# Altium project Pod3.PrjPcb
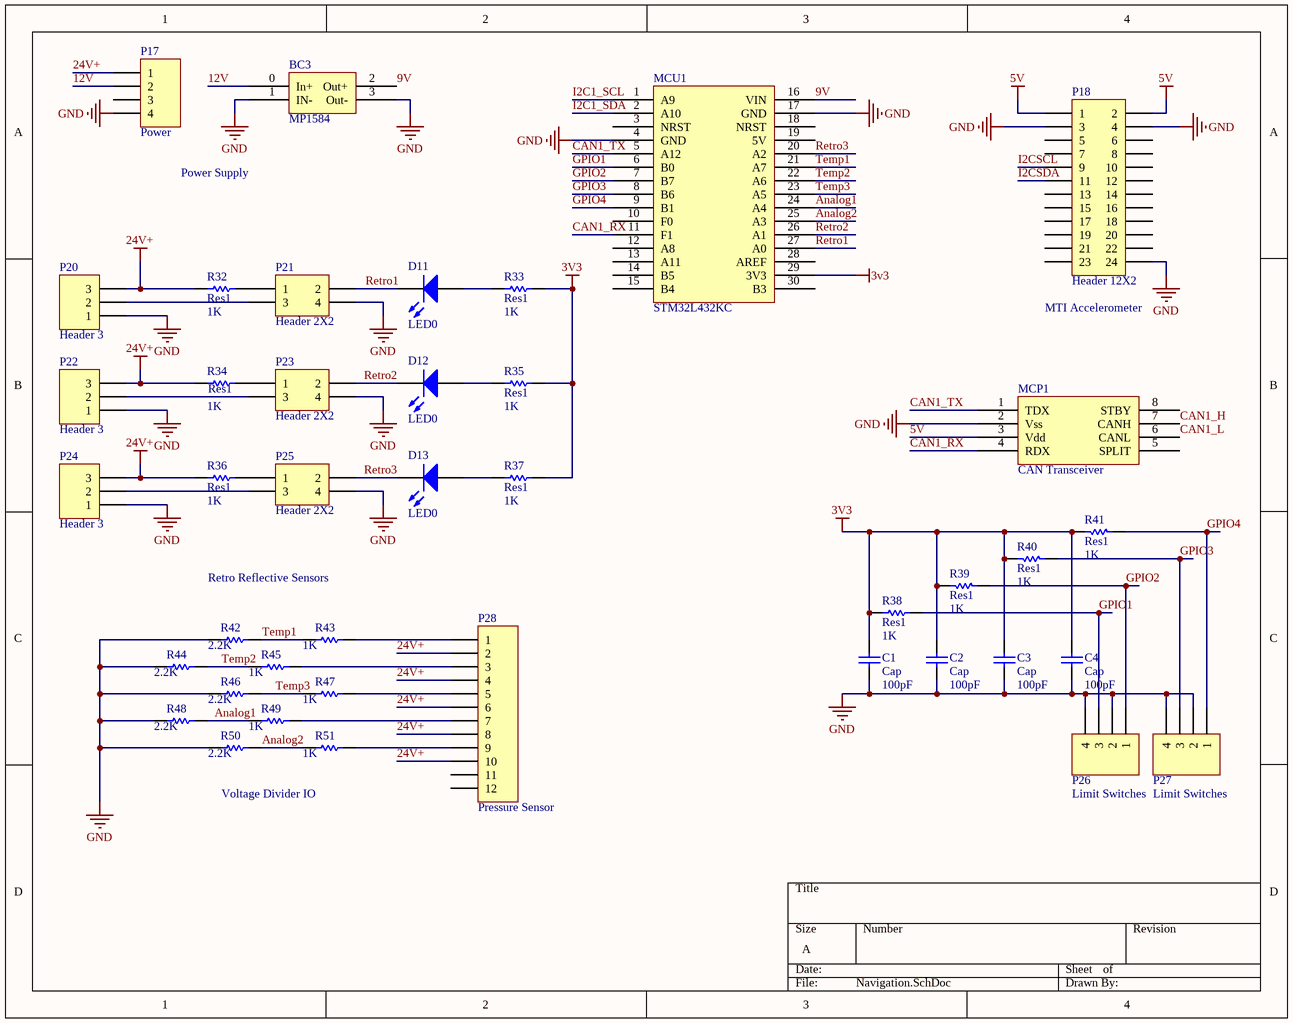
[diagram p0: Navigation.SchDoc]
3 sheets, 88 parts. Net scope: flat (ports and power ports of the same name join across sheets).
Board files: Navigation.PcbDoc, Braking.PcbDoc, Propulsion.PcbDoc, Communication.PcbDoc, ControlPanel.PcbDoc
Sheets:
  Navigation.SchDoc
  Communication.SchDoc
  MotorController.SchDoc

## Sheet Navigation.SchDoc
size A

### Parts
BC3  MP1584
C1  Cap  value 100pF  [SMD Capacitor]
C2  Cap  value 100pF  [SMD Capacitor]
C3  Cap  value 100pF  [SMD Capacitor]
C4  Cap  value 100pF  [SMD Capacitor]
D11  LED0  [LED-0]
D12  LED0  [LED-0]
D13  LED0  [LED-0]
MCP1  CAN Transceiver
MCU1  STM32L432KC
P17  Power  [HDR1X4]
P18  Header 12X2  [HDR2X12]
P20  Header 3  [HDR1X3]
P21  Header 2X2  [HDR2X2]
P22  Header 3  [HDR1X3]
P23  Header 2X2  [HDR2X2]
P24  Header 3  [HDR1X3]
P25  Header 2X2  [HDR2X2]
P26  Limit Switches  [HDR1X4]
P27  Limit Switches  [HDR1X4]
P28  Pressure Sensor  [HDR1X12]
R32  Res1  value 1K  [SMD Resistor]
R33  Res1  value 1K  [SMD Resistor]
R34  Res1  value 1K  [SMD Resistor]
R35  Res1  value 1K  [SMD Resistor]
R36  Res1  value 1K  [SMD Resistor]
R37  Res1  value 1K  [SMD Resistor]
R38  Res1  value 1K  [SMD Resistor]
R39  Res1  value 1K  [SMD Resistor]
R40  Res1  value 1K  [SMD Resistor]
R41  Res1  value 1K  [SMD Resistor]
R42  value 2.2K  [SMD Resistor]  (hidden comment: Res1)
R43  value 1K  [SMD Resistor]  (hidden comment: Res1)
R44  value 2.2K  [SMD Resistor]  (hidden comment: Res1)
R45  value 1K  [SMD Resistor]  (hidden comment: Res1)
R46  value 2.2K  [SMD Resistor]  (hidden comment: Res1)
R47  value 1K  [SMD Resistor]  (hidden comment: Res1)
R48  value 2.2K  [SMD Resistor]  (hidden comment: Res1)
R49  value 1K  [SMD Resistor]  (hidden comment: Res1)
R50  value 2.2K  [SMD Resistor]  (hidden comment: Res1)
R51  value 1K  [SMD Resistor]  (hidden comment: Res1)

### Nets
3V3: C1.2 C2.2 C3.2 C4.2 MCU1.29(3V3) R33.2 R35.2 R37.2 R38.1 R39.2 R40.2 R41.2
5V: MCP1.3(Vdd) P18.1 P18.2
24V+: P17.1 P20.3 P22.3 P24.3 P28.2 P28.4 P28.6 P28.8 P28.10 R32.1 R34.1 R36.1
GND: BC3.1(IN-) BC3.3(Out-) C1.1 C2.1 C3.1 C4.1 MCP1.2(Vss) MCU1.4(GND) MCU1.17(GND) P17.4 P18.3 P18.4 P18.24 P20.1 P21.4 P22.1 P23.4 P24.1 P25.4 P26.2 P26.4 P27.2 P27.4 R42.1 R44.1 R46.1 R48.1 R50.1  [project net NetLabel69]
9V: BC3.2(Out+) MCU1.16(VIN)
12V: BC3.0(In+) P17.2
Analog1: MCU1.24(A4) R48.2 R49.1
Analog2: MCU1.25(A3) R50.2 R51.1
CAN1_H: MCP1.7(CANH)
CAN1_L: MCP1.6(CANL)
CAN1_RX: MCP1.4(RDX) MCU1.11(F1)
CAN1_TX: MCP1.1(TDX) MCU1.5(A12)
GPIO1: MCU1.6(B0) P26.3 R38.2
GPIO2: MCU1.7(B7) P26.1 R39.1
GPIO3: MCU1.8(B6) P27.3 R40.1
GPIO4: MCU1.9(B1) P27.1 R41.1
I2C1_SCL: MCU1.1(A9)
I2C1_SDA: MCU1.2(A10)
I2CSCL: P18.9
I2CSDA: P18.11
Retro1: D11.2(K) MCU1.27(A0) P21.2
Retro2: D12.2(K) MCU1.26(A1) P23.2
Retro3: D13.2(K) MCU1.20(A2) P25.2
Temp1: MCU1.21(A7) R42.2 R43.1
Temp2: MCU1.22(A6) R44.2 R45.1
Temp3: MCU1.23(A5) R46.2 R47.1
NetD11_1: D11.1(A) R33.1
NetD12_1: D12.1(A) R35.1
NetD13_1: D13.1(A) R37.1
NetP20_2: P20.2 P21.3
NetP21_1: P21.1 R32.2
NetP22_2: P22.2 P23.3
NetP23_1: P23.1 R34.2
NetP24_2: P24.2 P25.3
NetP25_1: P25.1 R36.2
NetP28_1: P28.1 R43.2
NetP28_3: P28.3 R45.2
NetP28_5: P28.5 R47.2
NetP28_7: P28.7 R49.2
NetP28_9: P28.9 R51.2

Not connected (* = marked no-connect by the designer): MCP1 5(SPLIT) 8(STBY); MCU1 3(NRST) 10(F0) 12(A8) 13(A11) 14(B5) 15(B4) 18(NRST) 19(5V) 28(AREF) 30(B3); P17 3; P18 5 6 7 8 10 12 13 14 15 16 17 18 19 20 21 22 23; P28 11 12

### Notes on the sheet
- Power Supply
- (near P18) MTI Accelerometer
- Retro Reflective Sensors
- Voltage Divider IO

### Library data of the parts
C1-C4 = Cap: Capacitor; Published: 8-Jun-2000; LatestRevisionDate: 17-Jul-2002; LatestRevisionNote: Re-released for DXP Platform.; PackageReference: RAD-0.3; Publisher: Altium Limited; PackageDescription: Radial Cap, Thru-Hole; 2 Leads; 0.3 in Pin Spacing
D11-D13 = LED0: Typical INFRARED GaAs LED; Published: 8-Jun-2000; LatestRevisionDate: 08-Jul-2005; LatestRevisionNote: Mech Layer 1 removed.; PackageReference: LED-0; Publisher: Altium Limited; PackageDescription: LED; 2 Leads
MCP1 = CAN_TRANS: ComponentLink1Description: MCP2557FD; ComponentLink1URL: https://www.mouser.com/productdetail/microchip-technology/mcp2557fd-h-sn?qs=sGAEpiMZZMsGqoCZrYwANkLWU4Se4IrDu%2FrtAtMTObg%3D
MCU1 = STMF303K8
P17 P26 P27 = Header 4: Header, 4-Pin; LatestRevisionDate: 17-Jul-2002; LatestRevisionNote: Re-released for DXP Platform.; Publisher: Altium Limited
P18 = Header 12X2: Header, 12-Pin, Dual row; LatestRevisionDate: 17-Jul-2002; LatestRevisionNote: Re-released for DXP Platform.; Publisher: Altium Limited
P20 P22 P24 = Header 3: Header, 3-Pin; LatestRevisionDate: 17-Jul-2002; LatestRevisionNote: Re-released for DXP Platform.; Publisher: Altium Limited
P21 P23 P25 = Header 2X2: Header, 2-Pin, Dual row; LatestRevisionDate: 17-Jul-2002; LatestRevisionNote: Re-released for DXP Platform.; Publisher: Altium Limited
P28 = Header 12: Header, 12-Pin; LatestRevisionDate: 17-Jul-2002; LatestRevisionNote: Re-released for DXP Platform.; Publisher: Altium Limited
R32-R51 = Res1: Resistor; Published: 8-Jun-2000; LatestRevisionDate: 17-Jul-2002; LatestRevisionNote: Re-released for DXP Platform.; PackageReference: AXIAL-0.3; Publisher: Altium Limited; PackageDescription: Axial Device, Thru-Hole; 2 Leads; 0.3 in Pin Spacing

## Sheet Communication.SchDoc
size A; SheetNumber: 4
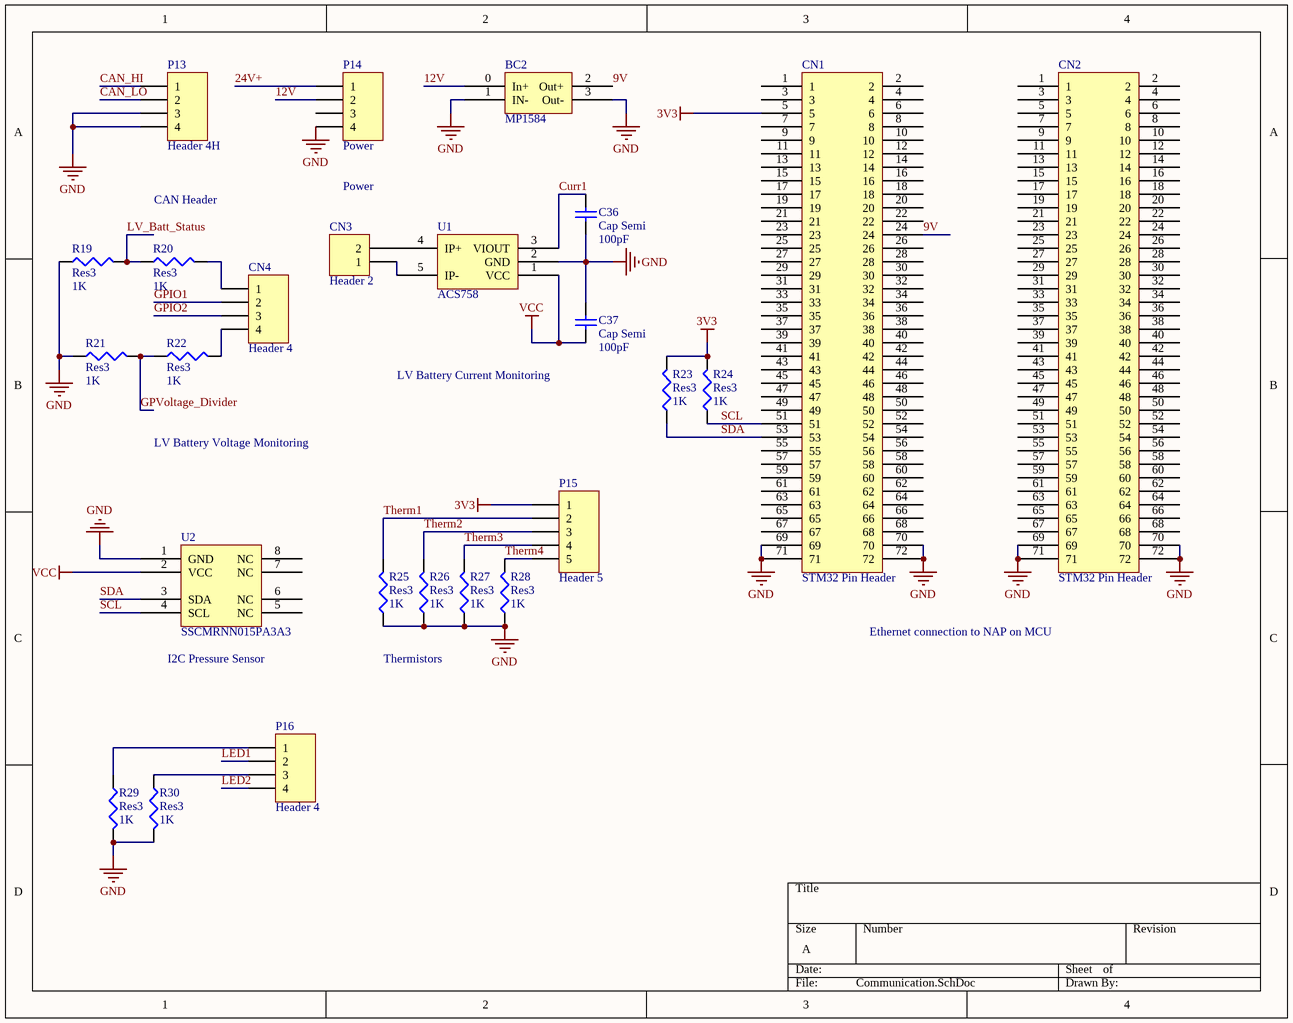
[diagram p1: Communication.SchDoc]

### Parts
BC2  MP1584
C36  Cap Semi  value 100pF  [C1206]
C37  Cap Semi  value 100pF  [C1206]
CN1  STM32 Pin Header
CN2  STM32 Pin Header
CN3  Header 2  [HDR1X2]
CN4  Header 4  [HDR1X4]
P13  Header 4H  [HDR1X4H]
P14  Power  [HDR1X4]
P15  Header 5  [HDR1X5]
P16  Header 4  [HDR1X4]
R19  Res3  value 1K  [J1-0603]
R20  Res3  value 1K  [J1-0603]
R21  Res3  value 1K  [J1-0603]
R22  Res3  value 1K  [J1-0603]
R23  Res3  value 1K  [J1-0603]
R24  Res3  value 1K  [J1-0603]
R25  Res3  value 1K  [J1-0603]
R26  Res3  value 1K  [J1-0603]
R27  Res3  value 1K  [J1-0603]
R28  Res3  value 1K  [J1-0603]
R29  Res3  value 1K  [J1-0603]
R30  Res3  value 1K  [J1-0603]
U1  ACS758  [ACS758]
U2  SSCMRNN015PA3A3  [Honeywell SMD]

### Nets
3V3: CN1.5 P15.1 R23.2 R24.2
GND: BC2.1(IN-) BC2.3(Out-) C36.1 C37.2 CN1.69 CN1.70 CN1.71 CN1.72 CN2.69 CN2.70 CN2.71 CN2.72 P13.3 P13.4 P14.4 R19.1 R21.1 R25.1 R26.1 R27.1 R28.1 R29.2 R30.2 U1.2(GND) U2.1(GND)  [project net NetLabel69]
VCC: C37.1 U1.1(VCC) U2.2(VCC)
9V: BC2.2(Out+) CN1.24
12V: BC2.0(In+) P14.2
24V+: P14.1
CAN_HI: P13.1
CAN_LO: P13.2
Curr1: C36.2 U1.3(VIOUT)
GPIO1: CN4.2
GPIO2: CN4.3
GPVoltage_Divider: R21.2 R22.1
LED1: P16.2
LED2: P16.4
LV_Batt_Status: R19.2 R20.1
SCL: CN1.51 R24.1 U2.4(SCL)
SDA: CN1.53 R23.1 U2.3(SDA)
Therm1: P15.2 R25.2
Therm2: P15.3 R26.2
Therm3: P15.4 R27.2
Therm4: P15.5 R28.2
NetCN3_1: CN3.1 U1.5(IP-)
NetCN3_2: CN3.2 U1.4(IP+)
NetCN4_1: CN4.1 R20.2
NetCN4_4: CN4.4 R22.2
NetP16_1: P16.1 R29.1
NetP16_3: P16.3 R30.1

Not connected (* = marked no-connect by the designer): CN1 1 2 3 4 6 7 8 9 10 11 12 13 14 15 16 17 18 19 20 21 22 23 25 26 27 28 29 30 31 32 33 34 35 36 37 38 39 40 41 42 43 44 45 46 47 48 49 50 52 54 55 56 57 58 59 60 61 62 63 64 65 66 67 68; CN2 1 2 3 4 5 6 7 8 9 10 11 12 13 14 15 16 17 18 19 20 21 22 23 24 25 26 27 28 29 30 31 32 33 34 35 36 37 38 39 40 41 42 43 44 45 46 47 48 49 50 51 52 53 54 55 56 57 58 59 60 61 62 63 64 65 66 67 68; P14 3; U2 5(NC) 6(NC) 7(NC) 8(NC)

### Notes on the sheet
- CAN Header
- Power
- (near C37) LV Battery Current Monitoring
- LV Battery Voltage Monitoring
- Ethernet connection to NAP on MCU
- (near U2) I2C Pressure Sensor
- Thermistors

### Library data of the parts
C36 C37 = Cap Semi: Capacitor (Semiconductor SIM Model); Published: 8-Jun-2000; LatestRevisionDate: 29-May-2009; LatestRevisionNote: IPC-7351 Footprint Added.; PackageReference: C1206; Publisher: Altium Limited; PackageDescription: Chip Capacitor
CN3 = Header 2: Header, 2-Pin; LatestRevisionDate: 17-Jul-2002; LatestRevisionNote: Re-released for DXP Platform.; Publisher: Altium Limited
CN4 P14 P16 = Header 4: Header, 4-Pin; LatestRevisionDate: 17-Jul-2002; LatestRevisionNote: Re-released for DXP Platform.; Publisher: Altium Limited
P13 = Header 4H: Header, 4-Pin, Right Angle; LatestRevisionDate: 17-Jul-2002; LatestRevisionNote: Re-released for DXP Platform.; Publisher: Altium Limited
P15 = Header 5: Header, 5-Pin; LatestRevisionDate: 17-Jul-2002; LatestRevisionNote: Re-released for DXP Platform.; Publisher: Altium Limited
R19-R30 = Res3: Resistor; Published: 8-Jun-2000; LatestRevisionDate: 29-May-2009; LatestRevisionNote: IPC-7351 Footprint Added.; PackageReference: J1-0603; Publisher: Altium Limited; PackageDescription: Chip Resistor
U1 = CurrSens
U2 = AmbPressTemp

## Sheet MotorController.SchDoc
size A; SheetNumber: 3
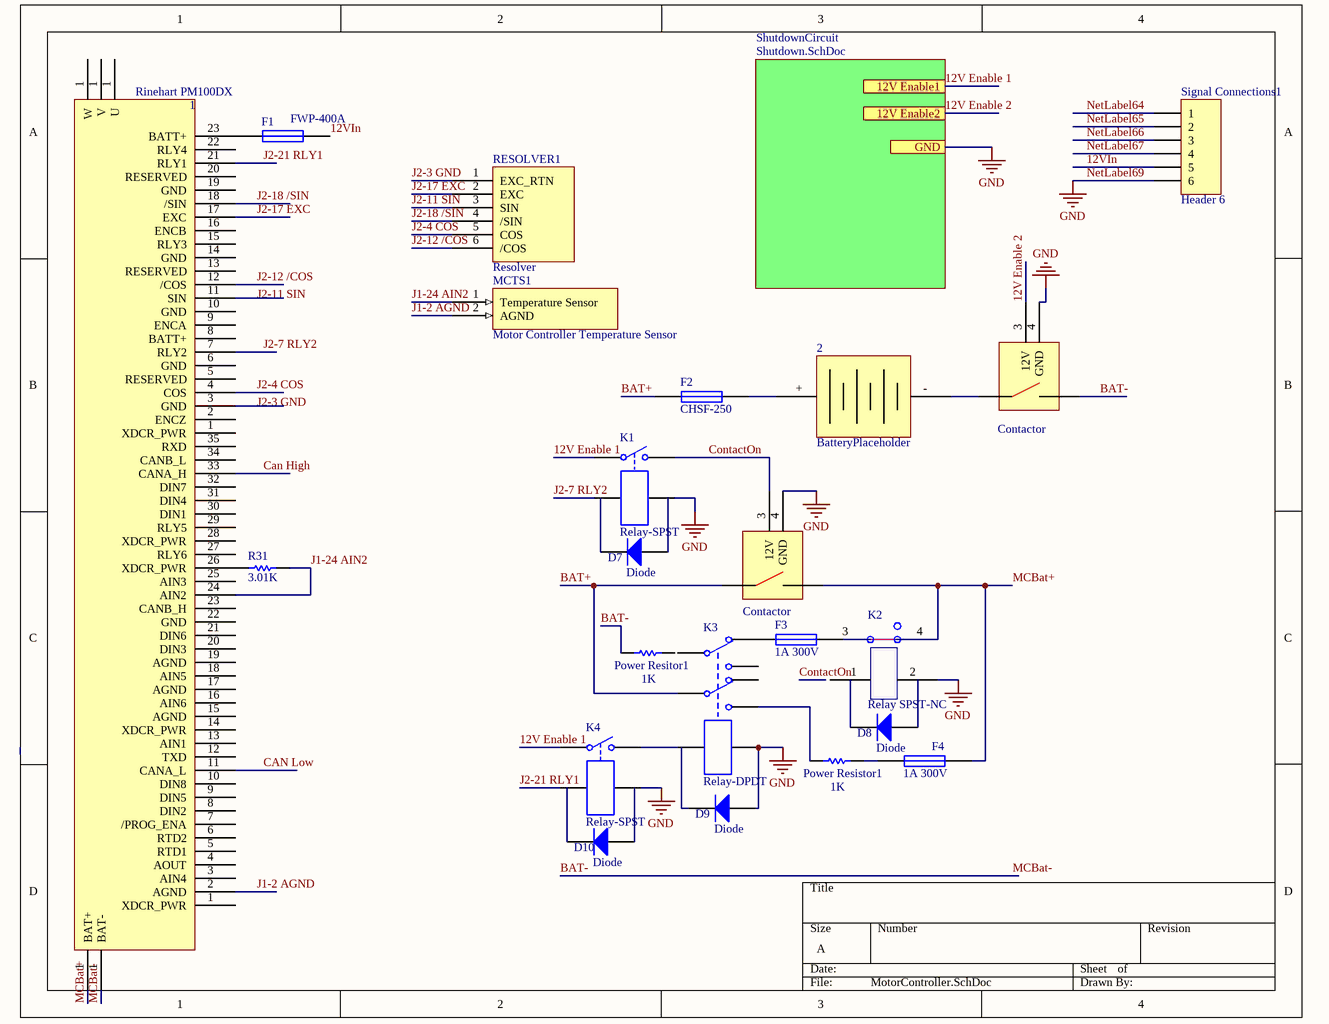
[diagram p2: MotorController.SchDoc]

### Parts
1  Rinehart PM100DX
2  BatteryPlaceholder
*1  Contactor
*2  Contactor
D7  Diode  [SMC]
D8  Diode  [SMC]
D9  Diode  [SMC]
D10  Diode  [SMC]
F1  FWP-400A  [PIN-W2/E2.8]
F2  CHSF-250  [PIN-W2/E2.8]
F3  1A 300V  [PIN-W2/E2.8]
F4  1A 300V  [PIN-W2/E2.8]
K1  Relay-SPST  [MODULE4]
K2  Relay SPST-NC
K3  Relay-DPDT  [DIP-P8]
K4  Relay-SPST  [MODULE4]
MCTS1  Motor Controller Temperature Sensor
Power_Resistor1  value 1K  [AXIAL-0.3]  (hidden comment: Res2)
Power_Resitor1  value 1K  [AXIAL-0.3]  (hidden comment: Res1)
R31  3.01K  [AXIAL-0.3]
RESOLVER1  Resolver
Signal_Connections1  Header 6  [HDR1X6]

### Sub-sheets
ShutdownCircuit = Shutdown.SchDoc (file not in this document): no entries

### Ports
12V Enable1, 12V Enable2, GND

### Nets
NetLabel69: *1.4(GND) *2.4(GND) D9.1(A) K1.4 K2.2 K3.8 K4.4 Signal_Connections1.6 ; port GND  [also labelled GND]
12V Enable 1: K1.1 K4.1 ; port 12V Enable1
12V Enable 2: *1.3(12V) ; port 12V Enable2
12VIn: F1.2 Signal_Connections1.5
BAT+: *2.1(+) F2.1 K3.4
BAT-: 1.1(BAT-) *1.2(-) Power_Resitor1.1  [also labelled MCBat-]
Can High: 1.33(CANA_H)
CAN Low: 1.11(CANA_L)
ContactOn: *2.3(12V) K1.2
J1-2 AGND: 1.2(AGND) MCTS1.2(AGND)
J1-24 AIN2: 1.24(AIN2) MCTS1.1(Temperature_Sensor) R31.2
J2-3 GND: RESOLVER1.1(EXC_RTN)
J2-4 COS: 1.4(AOUT) RESOLVER1.5(COS)
J2-7 RLY2: 1.7(/PROG_ENA) K1.3
J2-11 SIN: RESOLVER1.3(SIN)
J2-12 /COS: 1.12(TXD) RESOLVER1.6(/COS)
J2-17 EXC: 1.17(AGND) RESOLVER1.2(EXC)
J2-18 /SIN: 1.18(AIN5) RESOLVER1.4(/SIN)
J2-21 RLY1: 1.21(DIN6) K4.3
MCBat+: 1.1(XDCR_PWR) *2.2(-) F4.2 K2.4
NetLabel64: Signal_Connections1.1
NetLabel65: Signal_Connections1.2
NetLabel66: Signal_Connections1.3
NetLabel67: Signal_Connections1.4
Net1_23: 1.23(CANB_H) F1.1
Net1_26: 1.26(XDCR_PWR) R31.1
Net2_+: 2.+ F2.2
Net2_-: 2.- *1.1(+)
NetF3_2: F3.2 K2.3
NetF4_1: F4.1 Power_Resistor1.2
NetK3_6: K3.6 Power_Resistor1.1
NetK3_7: K3.7 K4.2

Not connected (* = marked no-connect by the designer): 1 3(AIN4) 5(RTD1) 6(RTD2) 8(DIN2) 9(DIN5) 10(DIN8) 13(AIN1) 14(XDCR_PWR) 15(AGND) 16(AIN6) 19(AGND) 20(DIN3) 22(GND) 25(AIN3) 27(RLY6) 28(XDCR_PWR) 29(RLY5) 30(DIN1) 31(DIN4) 32(DIN7) 34(CANB_L) 35(RXD); D7 1(A) 2(K); D8 1(A) 2(K); D9 2(K); D10 1(A) 2(K); F3 1; K2 1; K3 1 2 3 5; Power_Resitor1 2

### Notes on the sheet
- Labels drawn without touching a wire or pin: J2-3 GND, J2-11 SIN

### Library data of the parts
D7-D10 = Diode: Default Diode; Published: 8-Jun-2000; LatestRevisionDate: 17-Jul-2002; LatestRevisionNote: Re-released for DXP Platform.; PackageVersion: Sep-1996; PackageReference: SMC; Publisher: Altium Limited; PackageDescription: DO-214-AB/SMC; 2 C-Bend Leads; Body 7.9 x 5.9 mm, inc. leads (LxW); Code_JEDEC: DO-214-AB
F1-F4 = Fuse 1: Fuse; Published: 8-Jun-2000; LatestRevisionDate: 17-Jul-2002; LatestRevisionNote: Re-released for DXP Platform.; PackageReference: PIN-W2/E2.8; Publisher: Altium Limited; PackageDescription: Thru-Hole; 2 Leads
K1 K4 = Relay-SPST: Single-Pole Single-Throw Relay; Published: 24-Mar-1999; LatestRevisionDate: 17-Jul-2002; LatestRevisionNote: Re-released for DXP Platform.; PackageReference: MODULE4; Publisher: Altium Limited
K2 = Relay-SPST-NC
K3 = Relay-DPDT: Dual-Pole Dual-Throw Relay; Published: 24-Mar-1999; LatestRevisionDate: 17-Jul-2002; LatestRevisionNote: Re-released for DXP Platform.; PackageReference: DIP-P8; Publisher: Altium Limited; PackageDescription: Relay; 8 Leads
Power_Resistor1 Power_Resitor1 R31 = Res1: Resistor; Published: 8-Jun-2000; LatestRevisionDate: 17-Jul-2002; LatestRevisionNote: Re-released for DXP Platform.; PackageReference: AXIAL-0.3; Publisher: Altium Limited; PackageDescription: Axial Device, Thru-Hole; 2 Leads; 0.3 in Pin Spacing
Signal_Connections1 = Header 6: Header, 6-Pin; LatestRevisionDate: 17-Jul-2002; LatestRevisionNote: Re-released for DXP Platform.; Publisher: Altium Limited

## Nets that join several sheets
3V3: Navigation (12 pins), Communication (CN1.5 P15.1 R23.2 R24.2)
NetLabel69: Navigation (28 pins), Communication (25 pins), MotorController (8 pins)